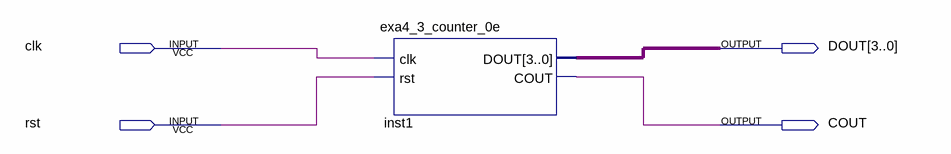
[diagram p0: schematic sheet]
// Quartus schematic experiment_four_task3.bdf as structural Verilog: 1 symbols, 4 pins
module experiment_four_task3 (
  input  clk,
  input  rst,
  output [3:0] DOUT,
  output COUT
);

  exa4_3_counter_0e inst1 (.clk(clk), .rst(rst), .DOUT(DOUT), .COUT(COUT));
endmodule
